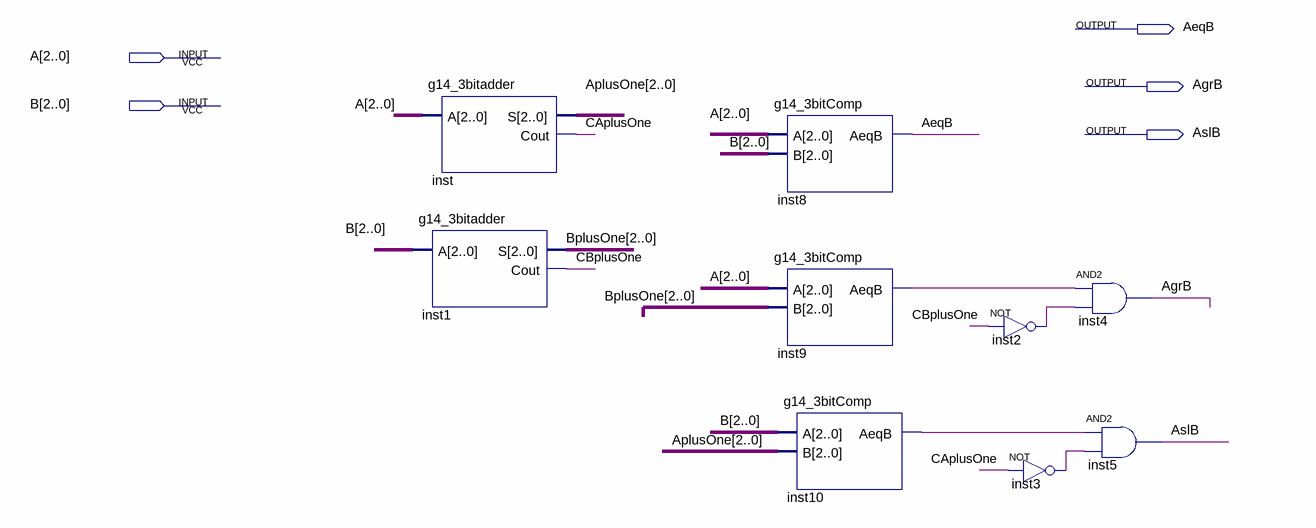
[diagram p0: schematic sheet]
// Quartus schematic g14_comp3.bdf as structural Verilog: 9 symbols, 5 pins
module g14_comp3 (
  input  [2:0] A,
  input  [2:0] B,
  output AeqB,
  output AgrB,
  output AslB
);

  wire CAplusOne, CBplusOne, inst2_out, inst3_out, inst9_aeqb, inst10_aeqb;
  wire [2:0] AplusOne, BplusOne;

  g14_3bitadder inst (.A(A), .S(AplusOne), .Cout(CAplusOne));
  g14_3bitadder inst1 (.A(B), .S(BplusOne), .Cout(CBplusOne));
  g14_3bitComp inst8 (.A(A), .B(B), .AeqB(AeqB));
  g14_3bitComp inst9 (.A(A), .B(BplusOne), .AeqB(inst9_aeqb));
  g14_3bitComp inst10 (.A(B), .B(AplusOne), .AeqB(inst10_aeqb));
  not inst2 (inst2_out, CBplusOne);
  not inst3 (inst3_out, CAplusOne);
  and inst4 (AgrB, inst9_aeqb, inst2_out);
  and inst5 (AslB, inst10_aeqb, inst3_out);
endmodule
